# Altium project Accumulator_Indicator_PCB.PrjPcb
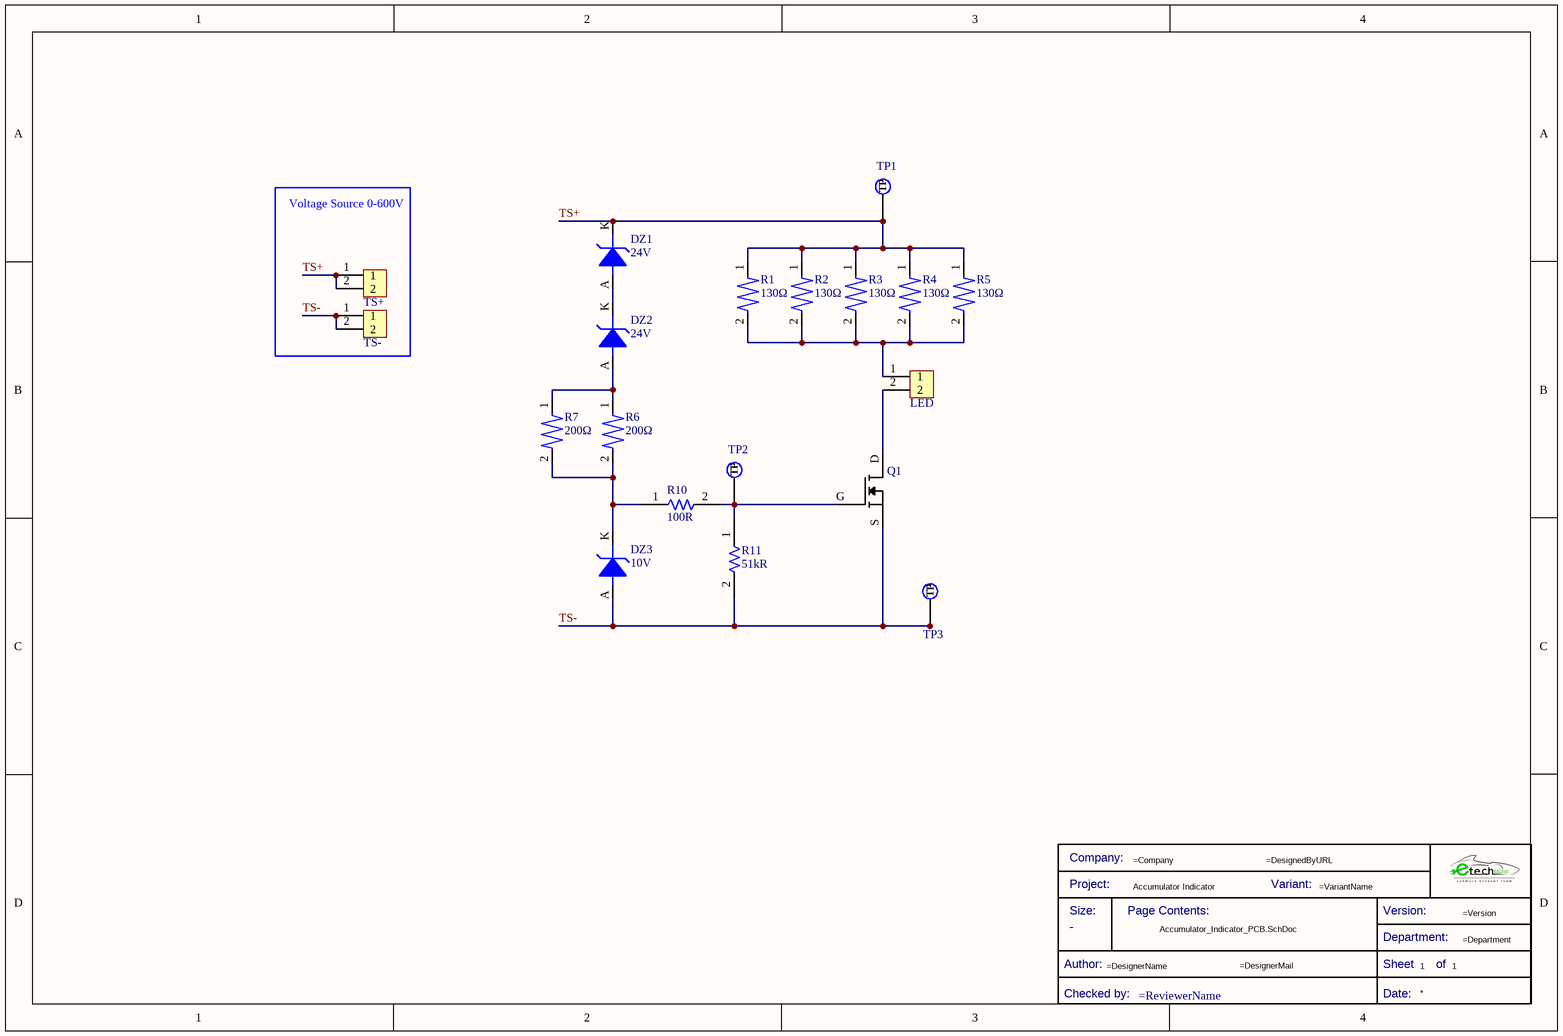
[diagram p0: Accumulator_Indicator_PCB.SchDoc]
Project: Accumulator Indicator
1 sheet, 20 parts. Net scope: global (net labels, ports and power ports of the same name join across sheets).
Board file: Accumulator_Indicator_PCB.PcbDoc

## Sheet Accumulator_Indicator_PCB.SchDoc
size A4; SheetNumber: 1; SheetTotal: 1

### Parts
*  Title Block_template  (value not drawn)  (graphical)
DZ1  24V  [DZ_24V_STD]
DZ2  24V  [DZ_24V_STD]
DZ3  10V  [DZ_24V_BZT52H-A10-Q]
LED  436500215  [J_MicroFit_2x1]  (value not drawn)
Q1  D2PAK type-A  [MOSFET-N-D2PAK]  (value not drawn)
R1  130Ω  [R130K_3W413]
R2  130Ω  [R130K_3W413]
R3  130Ω  [R130K_3W413]
R4  130Ω  [R130K_3W413]
R5  130Ω  [R130K_3W413]
R6  200Ω  [R200K_2W]
R7  200Ω  [R200K_2W]
R10  Resistance: 100R  [R1206FTK-W]  (hidden comment: CRG1206F100R)
R11  Resistance: 51kR  [R1206FTK-W]  (hidden comment: CRCW120610K0FKEA)
TP1  TestPoint  [TestPoint]  (value not drawn)  (no BOM)
TP2  TestPoint  [TestPoint]  (value not drawn)  (no BOM)
TP3  TestPoint  [TestPoint]  (value not drawn)  (no BOM)
TS+  436500215  [J_MicroFit_2x1]  (value not drawn)
TS-  436500215  [J_MicroFit_2x1]  (value not drawn)

### Blocks framed on the sheet
Voltage Source 0-600V: TS+ TS-

### Nets
TS+: DZ1.K R1.1 R2.1 R3.1 R4.1 R5.1 TP1.1(TP) TS+.1 TS+.2
TS-: DZ3.A Q1.S R11.2 TP3.1(TP) TS-.1 TS-.2
NetDZ1_A: DZ1.A DZ2.K
NetDZ2_A: DZ2.A R6.1 R7.1
NetDZ3_K: DZ3.K R6.2 R7.2 R10.1
NetLED_1: LED.1 R1.2 R2.2 R3.2 R4.2 R5.2
NetLED_2: LED.2 Q1.D
NetQ1_G: Q1.G R10.2 R11.1 TP2.1(TP)

### Notes on the sheet
- (in symbol Title Block_template) Company:; Project:; Variant:; Size:; Page Contents:; Version:; Department:; Author:; Sheet; of; Checked by:; Date:

### Library data of the parts
* = Title Block_template: Standard Title Block; .Creator: GP; Category: Title Block; .PCBcheck: GP; .SCHcheck: GP; Checked by:: =ReviewerName; Size: -
DZ1 DZ2 = DZ_24V_STD: BZX55C24
DZ3 = DZ_24V_BZT52H-A10-Q
LED TS+ TS- = J_MicroFit_2x1: Header 1 Row Vertical Polarizing Peg 2 Pin SMT/Glow Wire Compatible Tin Plate; Manufacturer 1: Molex; Manufacturer Part Number 1: 43650-0215; Supplier 1: Arrow Electronics; RoHS: Yes; Category: Headers and Wire Housings; Stock 1: 11086; Pricing 1: 1=0,87800, 10=0,74400, 80=0,63070, 3264=0,47000, 6528=0,45100, 13056=0,41760 (USD); ComponentLink1URL: https://datasheet.ciiva.com/19462/884109-19462034.pdf?src-supplier=Jameco; ComponentLink1Description: https://datasheet.ciiva.com/19462/884109-19462034.pdf?src-supplier=Jameco; ComponentLink2URL: https://datasheet.ciiva.com/5157/0436500215-pcb-headers-148687-5157608.pdf?src-supplier=Mouser; ComponentLink2Description: https://datasheet.ciiva.com/5157/0436500215-pcb-headers-148687-5157608.pdf?src-supplier=Mouser; ComponentLink3URL: https://datasheet.ciiva.com/16085/0436500215-pcb-headers-16085668.pdf?src-supplier=Onlinecomponents.com; ComponentLink3Description: https://datasheet.ciiva.com/16085/0436500215-pcb-headers-16085668.pdf?src-supplier=Onlinecomponents.com; ComponentLink4URL: https://datasheet.ciiva.com/11748/0900766b80307ce2-11748388.pdf?src-supplier=RSComponents; ComponentLink4Description: https://datasheet.ciiva.com/11748/0900766b80307ce2-11748388.pdf?src-supplier=RSComponents; ComponentLink5URL: https://datasheet.ciiva.com/9432/0436500215-pcb-headers-9432850.pdf?src-supplier=Avnet; ComponentLink5Description: https://datasheet.ciiva.com/9432/0436500215-pcb-headers-9432850.pdf?src-supplier=Avnet; ComponentLink6URL: https://datasheet.ciiva.com/7920/1889390-7920892.pdf?src-supplier=Element14; ComponentLink6Description: https://datasheet.ciiva.com/7920/1889390-7920892.pdf?src-supplier=Element14; Supplier Part Number 1: 43650-0215
Q1 = MOSFET-N-D2PAK: STB36N60M6
R1-R5 = R130K_3W413
R6 R7 = R200K_2W
R10 = R100-1206FTK: Res Thick Film 1206 100 Ohm 1% 0.25W(1/4W) ±200ppm/C Pad SMD T/R; Manufacturer: TE Connectivity; Temperature Coefficient: 200ppm/°C; Max Power Dissipation: 250mW; Voltage Rating: 200V; Number of Resistors: 1; .Creator: AC; Category: Resistor; ComponentLink1Description: Datasheet; ComponentLink1URL: https://docs.rs-online.com/7aab/0900766b815b7339.pdf; ComponentLink2Description: Where buy it; ComponentLink2URL: https://es.rs-online.com/web/p/resistencias-de-montaje-en-superficie/2232120; Supplier 1: Digi-Key; Manufacturer Part Number: CRG1206F100R; RoHS: Yes; Stock 1: 13476; Pricing 1: 1=0,10000, 10=0,07600, 100=0,02920, 1000=0,01285, 2500=0,01110 (USD); Mount: Surface Mount; Case/Package: 1206; Case Code (Imperial): 1206; Case Code (Metric): 3216; Weight: 0.000571oz; Min Operating Temperature: -55°C; Max Operating Temperature: 125°C; Tolerance: 1%; Resistor Type: Thick Film; Packaging: Tape and Reel; Package Quantity: 5000; Number of Terminations: 2; Series: CRG, Neohm; Power Rating: 250mW; Termination: Solder; Technology: THICK FILM; Length: 3.1mm; Width: 1.55mm; Height: 0.55mm; Depth: 1.55mm; Radiation Hardening: No; RoHS Compliant: Yes; ELV: Compliant; ComponentLink3URL: https://datasheet.ciiva.com/11808/0900766b800a696e-11808648.pdf?src-supplier=RSComponents; ComponentLink3Description: https://datasheet.ciiva.com/11808/0900766b800a696e-11808648.pdf?src-supplier=RSComponents; ComponentLink4URL: https://datasheet.ciiva.com/16763/70063020-16763547.pdf?src-supplier=Allied+Electronics; ComponentLink4Description: https://datasheet.ciiva.com/16763/70063020-16763547.pdf?src-supplier=Allied+Electronics; ComponentLink5URL: https://datasheet.ciiva.com/5562/eng-ds-1773204-g-5562604.pdf?src-supplier=Mouser; ComponentLink5Description: https://datasheet.ciiva.com/5562/eng-ds-1773204-g-5562604.pdf?src-supplier=Mouser; Supplier Part Number 1: A106068CT-ND
R11 = R51k-1206FTK: Res Thick Film 1206 51K Ohm 1% 1/4W ±100ppm/°C Molded SMD SMD Punched Carrier T/R; Manufacturer: Panasonic; Manufacturer Part Number: ERJ-S08F5102V; Power Rating: 250mW; Voltage Rating: 150V; Voltage Rating (DC): 200V; Current Rating: 2A; .Creator: DO; Category: Resistor; ComponentLink1Description: Datasheet; ComponentLink1URL: https://docs.rs-online.com/bca8/A700000006404581.pdf; ComponentLink2Description: Where buy it; ComponentLink2URL: https://es.rs-online.com/web/p/resistencias-de-montaje-en-superficie/6791765; Supplier 1: Mouser; RoHS: Yes; Stock 1: 4091; Pricing 1: 1=0,31000, 10=0,26700, 50=0,26700, 100=0,10700, 1000=0,05100, 10000=0,03400 (USD); Mount: Surface Mount; Case/Package: 1206; Case Code (Metric): 3216; Case Code (Imperial): 1206; Contact Plating: Tin; Min Operating Temperature: -55°C; Max Operating Temperature: 155°C; Packaging: Tape and Reel; Tolerance: 1%; Package Quantity: 5000; Resistor Type: Thick Film; Number of Terminations: 2; Temperature Coefficient: 100ppm/°C; Max Power Dissipation: 250mW; Features: Anti-Sulfur; Series: ERJ; Construction: Rectangular; Length: 3.2mm; Width: 0.063inch; Height: 0.028inch; Depth: 1.6mm; Military Standard: Not; Lead Free: Lead Free; RoHS Compliant: Yes; ComponentLink3URL: https://datasheet.ciiva.com/24023/aoa0000ce5-24023518.pdf?src-supplier=Mouser; ComponentLink3Description: https://datasheet.ciiva.com/24023/aoa0000ce5-24023518.pdf?src-supplier=Mouser; ComponentLink4URL: https://datasheet.ciiva.com/9189/aoa0000ce5-9189211.pdf?src-supplier=Avnet; ComponentLink4Description: https://datasheet.ciiva.com/9189/aoa0000ce5-9189211.pdf?src-supplier=Avnet; Supplier Part Number 1: 667-ERJ-S08F5102V
TP1-TP3 = TestPoint: Test Point 1x1 mm; .Creator: GP; Category: TestPoint; .PCBcheck: GP; .SCHcheck: GP